# Altium schematic sheet 0301_LTC6820_chip.SchDoc
size A3; DocumentNumber: 6; SheetNumber: 6; SheetTotal: 6; SheetDescription: LTC6820
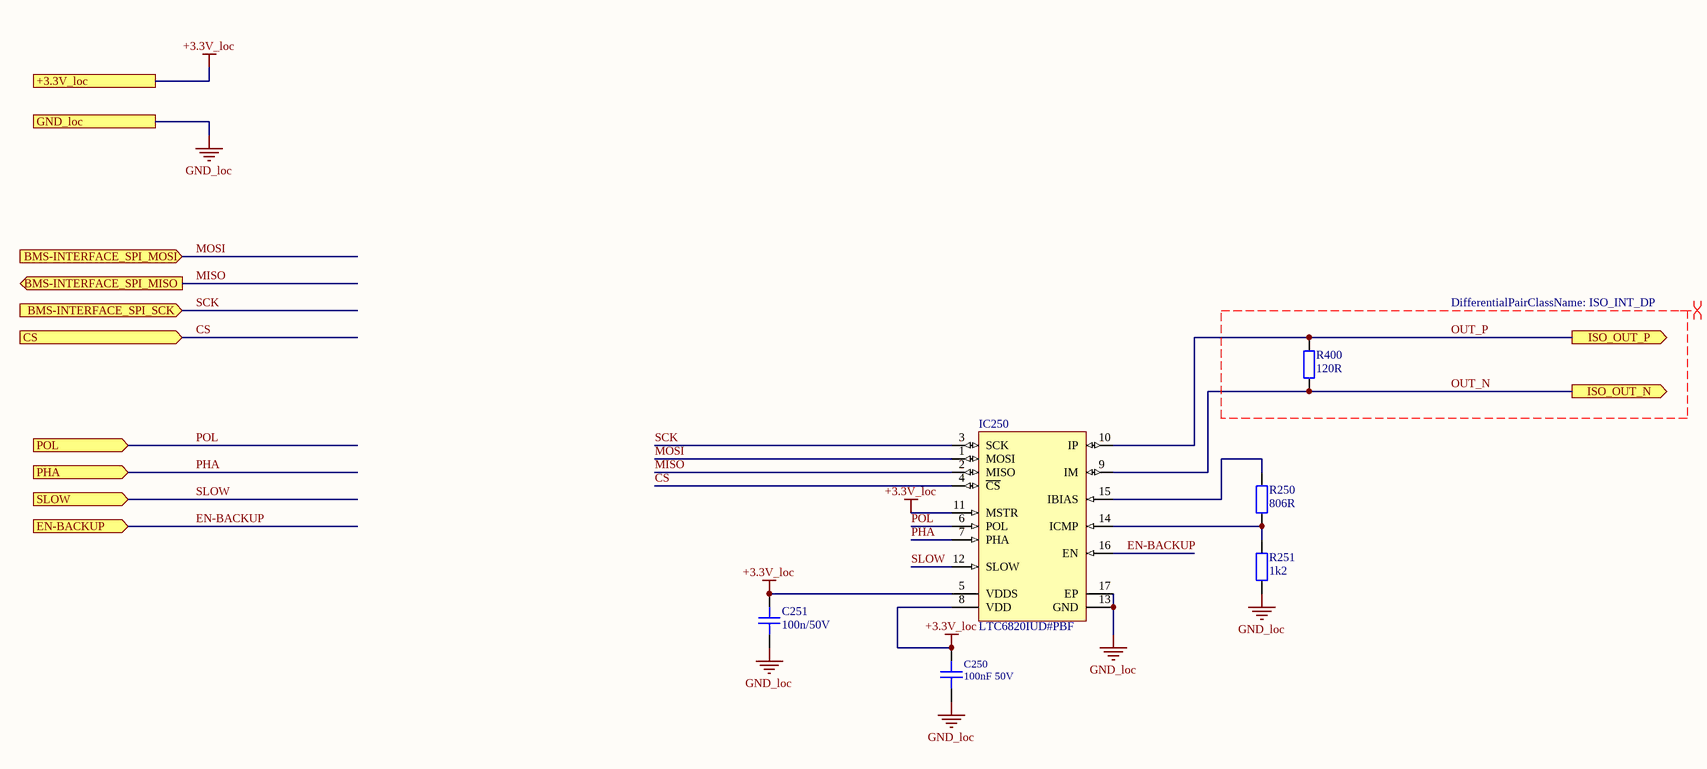
[diagram p0: 0301_LTC6820_chip.SchDoc]

## Parts
C250  100nF 50V  [0603C]
C251  100n/50V  [0603C]
IC250  LTC6820IUD#PBF  [LT-UD-16-EPV-AA_L]
R250  806R  [0603R]
R251  1k2  [0603R]
R400  120R  [0603R]

## Ports
+3.3V_loc, BMS-INTERFACE_SPI_MISO (out), BMS-INTERFACE_SPI_MOSI (in), BMS-INTERFACE_SPI_SCK (in), CS (in), EN-BACKUP (in), GND_loc, ISO_OUT_N (out), ISO_OUT_P (out), PHA (in), POL (in), SLOW (in)

## Nets
+3.3V_loc: C250.2 C251.2 IC250.5(VDDS) IC250.8(VDD) IC250.11(MSTR) ; port +3.3V_loc
GND_loc: C250.1 C251.1 IC250.13(GND) IC250.17(EP) R251.1 ; port GND_loc
CS: IC250.4(~{CS}) ; port CS
EN-BACKUP: IC250.16(EN) ; port EN-BACKUP
MISO: IC250.2(MISO) ; port BMS-INTERFACE_SPI_MISO
MOSI: IC250.1(MOSI) ; port BMS-INTERFACE_SPI_MOSI
OUT_N: IC250.9(IM) R400.1 ; port ISO_OUT_N
OUT_P: IC250.10(IP) R400.2 ; port ISO_OUT_P
PHA: IC250.7(PHA) ; port PHA
POL: IC250.6(POL) ; port POL
SCK: IC250.3(SCK) ; port BMS-INTERFACE_SPI_SCK
SLOW: IC250.12(SLOW) ; port SLOW
NetIC250_14: IC250.14(ICMP) R250.1 R251.2
NetIC250_15: IC250.15(IBIAS) R250.2

## Layout directives
differential pair; differential pair class ISO_INT_DP; rule Differential Pairs Routing [Pref Gap = 25.59mil    Min Gap  = 5mil    Max Gap  = 78.74milPref Width = 6mil    Min Width  = 0.955mil    Max Width  = 10.997mil]: OUT_N, OUT_P

## Notes on the sheet
- Fraunhofer IISB
- Schottkystr. 10
- developed by:
- 91058 Erlangen
- Germany
- Author
- Project
- License
- Description
- File
- Version
- Release Date
- Sheet
- www.foxbms.org
- www.iisb.fraunhofer.de
- foxBMS Team
- /

## Library data of the parts
C250 = gen_C_ceramic_100n_50V_X7R_0603: Ceramic, 100nF, ±10%, 50V, X7R, –55 to 125°C, 0603 (1608),RoHS, Automotive; Part Number: GCJ188R71H104KA12; Manufacturer: Murata; Capacitance: 100n; Case EIA: 0603; Case Metric: 1608; PnP Package: C_0603_10; PnP Value: 100nF/50V/X7R; Automotive Qualified: True; Rated Voltage: 50V; Dielectric: X7R; Supplier 1: Digi-Key; Supplier Part Number 1: 490-5798-1-ND; Height - Seated (Max): 0.8mm; Mounting Type: SurfaceMount,MLCC; Operating Temperature: –55 to 125°C; Series: GCJ; Tolerance: ±10%; Manufacturer_Part_Number: GCJ188R71H104KA12
C251 = gen_C_ceramic_100n_50V_X7R_0603: MLCC; Capacitance: 100n; Rated Voltage: 50V; Dielectric: X7R; Case EIA: 0603; Case Metric: 1608; PnP Package: C_0603_10; PnP Value: 100n/50V/X7R; PnP equipped: x; Automotive Qualified: True; Part Number: gen_C_ceramic_100n_50V_X7R_0603; Supplier 1: Farnell; Supplier Part Number 1: 2525267; Supplier 2: Digikey; Supplier Part Number 2: 490-6049-1-ND; Supplier 3: Farnell; Supplier Part Number 3: 2070398
IC250 = CMP-0937-00013-1: IsoSPI Isolated Communication Interface, 2.7 to 5.5 V, -40 to 85 degC, 16-Pin QFN (UD-16EPV-AA), Pb-Free; Manufacturer: Linear Technology; VBIAS: 1.9 to 2.1 V; Receiver Input Resistance: 35 kOhm; IO Supply Voltage Range: 1.7 to 5.5 V; IO Supply Current: 1 uA Max.; Supply Current, IDLE State: 2 uA; ComponentLink3URL: http://cds.linear.com/docs/en/packaging/QFN_16_05-08-1700.pdf; PackageReference: UD-16EPV-AA; ComponentLink1URL: http://www.linear.com/; PartNumber: LTC6820IUD#PBF; Temperature Range (degC): -40 to 85; Mounting Technology: Surface Mount; PackageDescription: 16-Pin Quad Flat No-lead Package, Body 3 x 3 mm, Pitch 0.5 mm; DatasheetVersion: Rev. A; ComponentLink2Description: Datasheet; ComponentLink1Description: Manufacturer URL; PackageVersion: Rev. A; Power Supply: 2.7 to 5.5 V; ComponentLink2URL: http://cds.linear.com/docs/en/datasheet/6820fa.pdf; ComponentLink3Description: Package Specification
R250 = gen_R_806R_0603: SMD Resistor 806R 0603; Tolerance: 1%; Power: 0.1W; Case EIA: 0603; Case Metric: 1608; Maximum Working Voltage: 75V; PnP Package: R_0603; Automotive Qualified: True; Part Number: gen_R_806R_0603; Operating Temperature: -55°C - +155°C; Resistance: 806R; Series: E96; PnP Value: 806R; Supplier 1: Farnell; Supplier Part Number 1: 2059324
R251 = gen_R_1k2_0603: SMD Resistor 1k2 0603; Tolerance: 1%; Power: 0.1W; Case EIA: 0603; Case Metric: 1608; Maximum Working Voltage: 75V; PnP Package: R_0603; Automotive Qualified: True; Part Number: gen_R_1k2_0603; Operating Temperature: -55°C - +155°C; Resistance: 1k2; Series: E24; PnP Value: 1k2; Supplier 1: Farnell; Supplier Part Number 1: 2073370
R400 = gen_R_120R_0603: SMD Resistor 120R 0603; Tolerance: 1%; Power: 0.1W; Case EIA: 0603; Case Metric: 1608; Maximum Working Voltage: 75V; PnP Package: R_0603; Automotive Qualified: True; Part Number: gen_R_120R_0603; Operating Temperature: -55°C - +155°C; Resistance: 120R; Series: E24; PnP Value: 120R; Supplier 1: Farnell; Supplier Part Number 1: 1652832